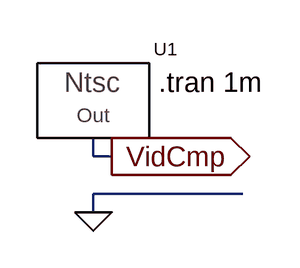
[diagram p0: schematic NtscGenTest.asc]
NtscGenTest.asc, the LTspice schematic file:
Version 4
SHEET 1 880 680
WIRE 96 160 96 144
WIRE 112 160 96 160
WIRE 224 192 96 192
WIRE 96 208 96 192
FLAG 96 208 0
FLAG 112 160 VidCmp
IOPIN 112 160 Out
SYMBOL Robertugo\\ntscgen 96 112 R0
SYMATTR InstName U1
TEXT 152 96 Left 0 !.tran 1m

The netlist it stands for:
* NtscGenTest.asc
XU1 VidCmp VIDEO  ; pins Out
.tran 1m
.lib NtscGen.sub
.backanno
.end